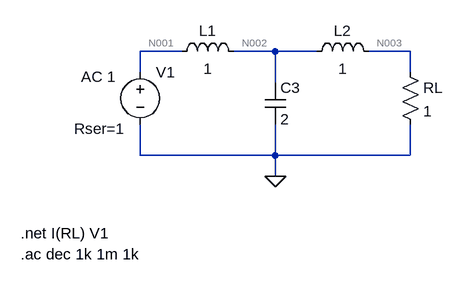
[diagram p0: schematic TS14.asc]
TS14.asc, the LTspice schematic file:
Version 4
SHEET 1 880 680
WIRE 16 128 -48 128
WIRE 160 128 96 128
WIRE 224 128 160 128
WIRE 368 128 304 128
WIRE -48 160 -48 128
WIRE 368 160 368 128
WIRE 160 176 160 128
WIRE -48 288 -48 240
WIRE 160 288 160 240
WIRE 160 288 -48 288
WIRE 368 288 368 240
WIRE 368 288 160 288
WIRE 160 320 160 288
FLAG 160 320 0
SYMBOL ind 0 144 R270
WINDOW 0 32 56 VTop 2
WINDOW 3 5 56 VBottom 2
SYMATTR InstName L1
SYMATTR Value 1
SYMBOL ind 208 144 R270
WINDOW 0 32 56 VTop 2
WINDOW 3 5 56 VBottom 2
SYMATTR InstName L2
SYMATTR Value 1
SYMBOL cap 144 176 R0
SYMATTR InstName C3
SYMATTR Value 2
SYMBOL res 352 144 R0
SYMATTR InstName RL
SYMATTR Value 1
SYMBOL voltage -48 144 R0
WINDOW 123 -91 23 Left 2
WINDOW 39 -102 103 Left 2
SYMATTR Value2 AC 1
SYMATTR SpiceLine Rser=1
SYMATTR InstName V1
SYMATTR Value ""
TEXT -232 408 Left 2 !.net I(RL) V1
TEXT -232 440 Left 2 !.ac dec 1k 1m 1k

The netlist it stands for:
* TS14.asc
L1 N001 N002 1
L2 N002 N003 1
C3 N002 0 2
RL N003 0 1
V1 N001 0 AC 1 Rser=1
.net I(RL) V1
.ac dec 1k 1m 1k
.backanno
.end

* Results of the author's LTspice run, read from the files saved beside the schematic
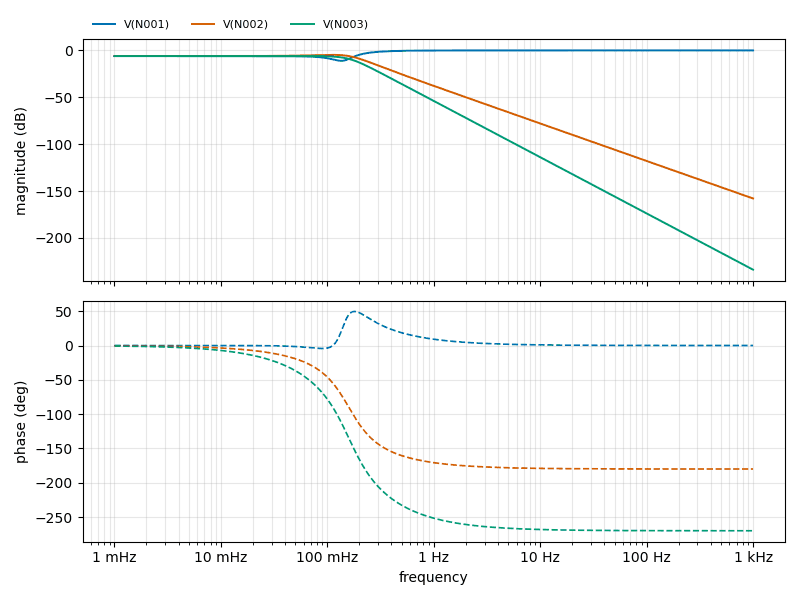
[diagram p1: AC Analysis of TS14.asc, plotted from the saved traces]
* AC Analysis, 1 run:
*   V(N001): -6.01 dB at 1 mHz, -0.00 dB at 1 kHz, peak -0.00 dB at 1 kHz, 3 dB below the peak at 231.4 mHz
*   V(N002): -6.02 dB at 1 mHz, -157.95 dB at 1 kHz, peak -4.78 dB at 112.5 mHz, 3 dB below the peak at 186 mHz
*   V(N003): -6.03 dB at 1 mHz, -233.91 dB at 1 kHz, peak -6.03 dB at 1 mHz, 3 dB below the peak at 159.1 mHz